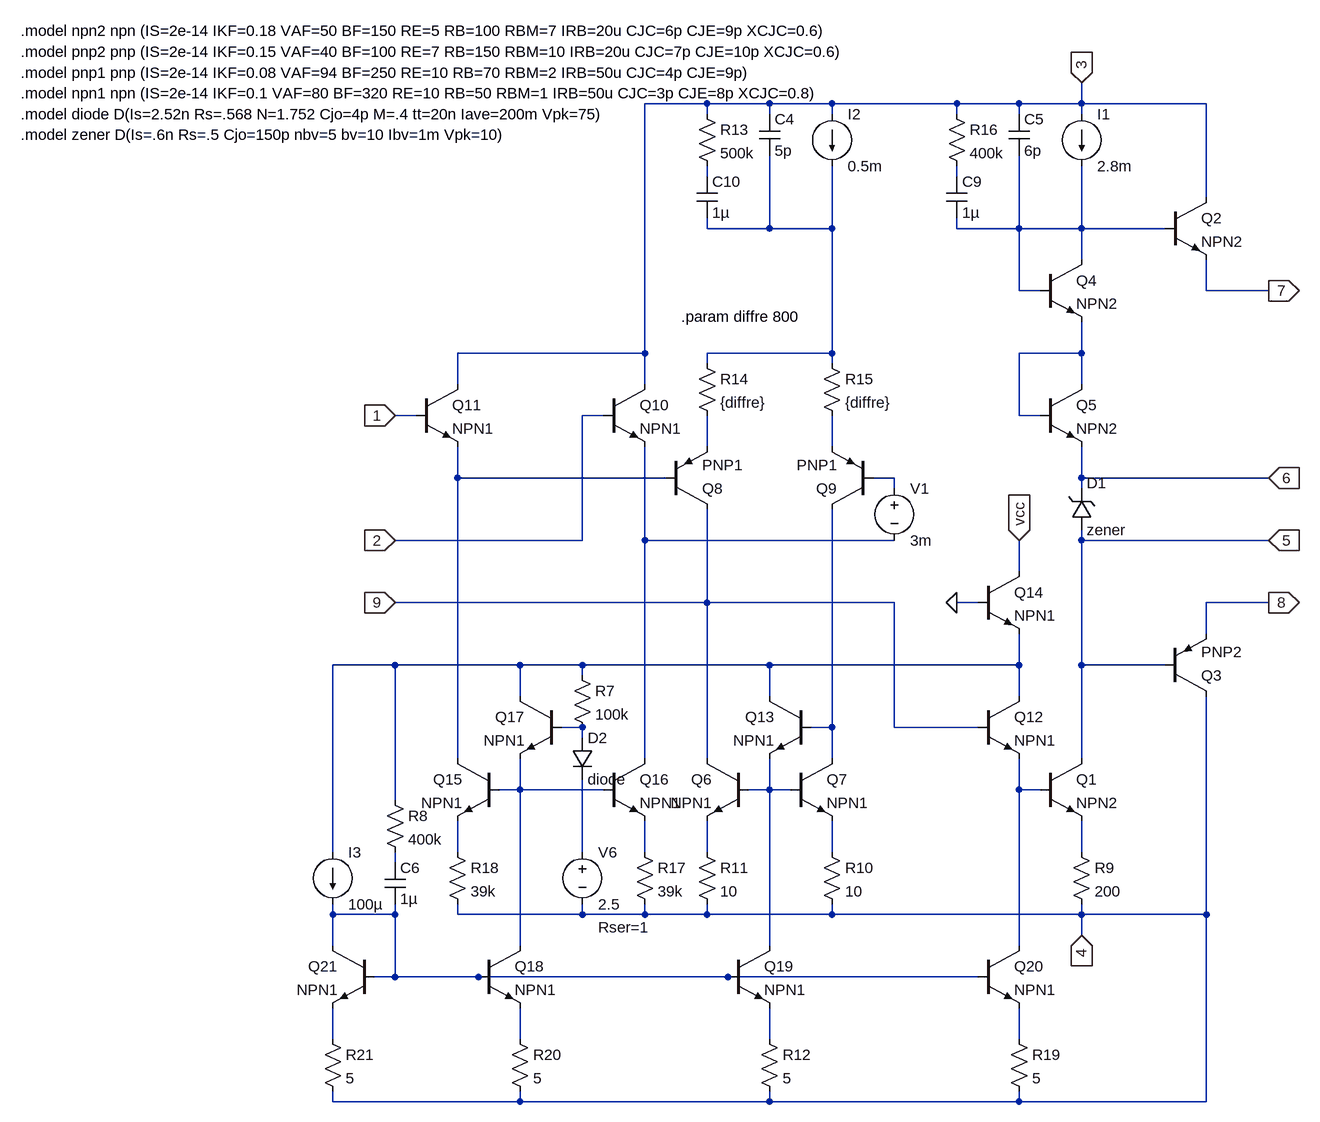
[diagram p0: schematic LME49810.asc]
LME49810.asc, the LTspice schematic file:
Version 4
SHEET 1 1204 680
WIRE 0 -1184 -96 -1184
WIRE 96 -1184 0 -1184
WIRE 192 -1184 96 -1184
WIRE 384 -1184 192 -1184
WIRE 480 -1184 384 -1184
WIRE 576 -1184 576 -1216
WIRE 576 -1184 480 -1184
WIRE 768 -1184 576 -1184
WIRE 0 -1168 0 -1184
WIRE 96 -1168 96 -1184
WIRE 192 -1168 192 -1184
WIRE 384 -1168 384 -1184
WIRE 480 -1168 480 -1184
WIRE 576 -1168 576 -1184
WIRE 0 -1072 0 -1088
WIRE 384 -1072 384 -1088
WIRE 768 -1040 768 -1184
WIRE 0 -992 0 -1008
WIRE 96 -992 96 -1104
WIRE 96 -992 0 -992
WIRE 192 -992 192 -1088
WIRE 192 -992 96 -992
WIRE 384 -992 384 -1008
WIRE 480 -992 480 -1104
WIRE 480 -992 384 -992
WIRE 576 -992 576 -1088
WIRE 576 -992 480 -992
WIRE 704 -992 576 -992
WIRE 576 -944 576 -992
WIRE 480 -896 480 -992
WIRE 512 -896 480 -896
WIRE 768 -896 768 -944
WIRE 864 -896 768 -896
WIRE -96 -800 -96 -1184
WIRE -96 -800 -384 -800
WIRE 192 -800 192 -992
WIRE 192 -800 0 -800
WIRE 576 -800 576 -848
WIRE 576 -800 480 -800
WIRE 0 -784 0 -800
WIRE 192 -784 192 -800
WIRE -384 -752 -384 -800
WIRE -96 -752 -96 -800
WIRE 576 -752 576 -800
WIRE -448 -704 -480 -704
WIRE -160 -704 -192 -704
WIRE 480 -704 480 -800
WIRE 512 -704 480 -704
WIRE 0 -656 0 -704
WIRE 192 -656 192 -704
WIRE -384 -608 -384 -656
WIRE -64 -608 -384 -608
WIRE 288 -608 256 -608
WIRE 576 -608 576 -656
WIRE 864 -608 576 -608
WIRE 288 -592 288 -608
WIRE 576 -592 576 -608
WIRE -192 -512 -192 -704
WIRE -192 -512 -480 -512
WIRE -96 -512 -96 -656
WIRE 288 -512 -96 -512
WIRE 576 -512 576 -528
WIRE 864 -512 576 -512
WIRE 480 -464 480 -512
WIRE 0 -416 0 -560
WIRE 0 -416 -480 -416
WIRE 288 -416 0 -416
WIRE 416 -416 384 -416
WIRE 864 -416 768 -416
WIRE 768 -368 768 -416
WIRE -480 -320 -576 -320
WIRE -288 -320 -480 -320
WIRE -192 -320 -288 -320
WIRE 96 -320 -192 -320
WIRE 480 -320 480 -368
WIRE 480 -320 96 -320
WIRE 576 -320 576 -512
WIRE 704 -320 576 -320
WIRE -192 -304 -192 -320
WIRE -288 -272 -288 -320
WIRE 96 -272 96 -320
WIRE 480 -272 480 -320
WIRE -192 -224 -224 -224
WIRE 192 -224 192 -560
WIRE 192 -224 160 -224
WIRE 288 -224 288 -416
WIRE 416 -224 288 -224
WIRE -192 -208 -192 -224
WIRE -384 -176 -384 -608
WIRE -96 -176 -96 -512
WIRE 0 -176 0 -416
WIRE 192 -176 192 -224
WIRE 576 -176 576 -320
WIRE -288 -128 -288 -176
WIRE -288 -128 -320 -128
WIRE -160 -128 -288 -128
WIRE 96 -128 96 -176
WIRE 96 -128 64 -128
WIRE 128 -128 96 -128
WIRE 480 -128 480 -176
WIRE 512 -128 480 -128
WIRE -480 -112 -480 -320
WIRE -576 -32 -576 -320
WIRE -384 -32 -384 -80
WIRE -192 -32 -192 -144
WIRE -96 -32 -96 -80
WIRE 0 -32 0 -80
WIRE 192 -32 192 -80
WIRE 576 -32 576 -80
WIRE -480 -16 -480 -32
WIRE -576 64 -576 48
WIRE -480 64 -480 48
WIRE -480 64 -576 64
WIRE -384 64 -384 48
WIRE -192 64 -192 48
WIRE -192 64 -384 64
WIRE -96 64 -96 48
WIRE -96 64 -192 64
WIRE 0 64 0 48
WIRE 0 64 -96 64
WIRE 192 64 192 48
WIRE 192 64 0 64
WIRE 576 64 576 48
WIRE 576 64 192 64
WIRE 768 64 768 -272
WIRE 768 64 576 64
WIRE 576 96 576 64
WIRE -576 112 -576 64
WIRE -288 112 -288 -128
WIRE 96 112 96 -128
WIRE 480 112 480 -128
WIRE -480 160 -480 64
WIRE -480 160 -512 160
WIRE -352 160 -480 160
WIRE 32 160 -352 160
WIRE 416 160 32 160
WIRE -576 256 -576 208
WIRE -288 256 -288 208
WIRE 96 256 96 208
WIRE 480 256 480 208
WIRE -576 352 -576 336
WIRE -288 352 -288 336
WIRE -288 352 -576 352
WIRE 96 352 96 336
WIRE 96 352 -288 352
WIRE 480 352 480 336
WIRE 480 352 96 352
WIRE 768 352 768 64
WIRE 768 352 480 352
FLAG -480 -704 1
IOPIN -480 -704 In
FLAG -480 -512 2
IOPIN -480 -512 In
FLAG -480 -416 9
IOPIN -480 -416 In
FLAG 576 96 4
IOPIN 576 96 In
FLAG 576 -1216 3
IOPIN 576 -1216 In
FLAG 864 -896 7
IOPIN 864 -896 Out
FLAG 864 -416 8
IOPIN 864 -416 Out
FLAG 864 -608 6
IOPIN 864 -608 In
FLAG 864 -512 5
IOPIN 864 -512 In
FLAG 384 -416 0
FLAG 480 -512 vcc
IOPIN 480 -512 In
SYMBOL npn 512 -176 R0
SYMATTR InstName Q1
SYMATTR Value NPN2
SYMBOL current 576 -1168 R0
WINDOW 123 0 0 Left 0
WINDOW 39 0 0 Left 0
SYMATTR InstName I1
SYMATTR Value 2.8m
SYMBOL npn 704 -1040 R0
SYMATTR InstName Q2
SYMATTR Value NPN2
SYMBOL pnp 704 -272 M180
SYMATTR InstName Q3
SYMATTR Value PNP2
SYMBOL npn 512 -944 R0
SYMATTR InstName Q4
SYMATTR Value NPN2
SYMBOL npn 512 -752 R0
SYMATTR InstName Q5
SYMATTR Value NPN2
SYMBOL cap 464 -1168 R0
SYMATTR InstName C5
SYMATTR Value 6p
SYMBOL zener 560 -528 M180
WINDOW 0 24 72 Left 0
WINDOW 3 24 0 Left 0
SYMATTR InstName D1
SYMATTR Value zener
SYMATTR Description Diode
SYMATTR Type diode
SYMBOL npn 64 -176 M0
SYMATTR InstName Q6
SYMATTR Value NPN1
SYMBOL npn 128 -176 R0
SYMATTR InstName Q7
SYMATTR Value NPN1
SYMBOL res 176 -48 R0
SYMATTR InstName R10
SYMATTR Value 10
SYMBOL res -16 -48 R0
SYMATTR InstName R11
SYMATTR Value 10
SYMBOL pnp -64 -560 M180
SYMATTR InstName Q8
SYMATTR Value PNP1
SYMBOL pnp 256 -560 R180
SYMATTR InstName Q9
SYMATTR Value PNP1
SYMBOL current 192 -1168 R0
WINDOW 123 0 0 Left 0
WINDOW 39 0 0 Left 0
SYMATTR InstName I2
SYMATTR Value 0.5m
SYMBOL cap 80 -1168 R0
SYMATTR InstName C4
SYMATTR Value 5p
SYMBOL res -16 -1184 R0
SYMATTR InstName R13
SYMATTR Value 500k
SYMBOL res -16 -800 R0
SYMATTR InstName R14
SYMATTR Value {diffre}
SYMBOL res 176 -800 R0
SYMATTR InstName R15
SYMATTR Value {diffre}
SYMBOL voltage 288 -608 R0
WINDOW 123 0 0 Left 0
WINDOW 39 0 0 Left 0
SYMATTR InstName V1
SYMATTR Value 3m
SYMBOL npn -160 -752 R0
SYMATTR InstName Q10
SYMATTR Value NPN1
SYMBOL npn -448 -752 R0
SYMATTR InstName Q11
SYMATTR Value NPN1
SYMBOL npn 416 -272 R0
SYMATTR InstName Q12
SYMATTR Value NPN1
SYMBOL npn 160 -272 M0
SYMATTR InstName Q13
SYMATTR Value NPN1
SYMBOL cap -16 -1072 R0
SYMATTR InstName C10
SYMATTR Value 1µ
SYMBOL res 560 -48 R0
SYMATTR InstName R9
SYMATTR Value 200
SYMBOL res 368 -1184 R0
SYMATTR InstName R16
SYMATTR Value 400k
SYMBOL cap 368 -1072 R0
SYMATTR InstName C9
SYMATTR Value 1µ
SYMBOL npn 416 -464 R0
SYMATTR InstName Q14
SYMATTR Value NPN1
SYMBOL npn -320 -176 M0
SYMATTR InstName Q15
SYMATTR Value NPN1
SYMBOL npn -160 -176 R0
SYMATTR InstName Q16
SYMATTR Value NPN1
SYMBOL res -112 -48 R0
SYMATTR InstName R17
SYMATTR Value 39k
SYMBOL res -400 -48 R0
SYMATTR InstName R18
SYMATTR Value 39k
SYMBOL npn -224 -272 M0
SYMATTR InstName Q17
SYMATTR Value NPN1
SYMBOL res -208 -320 R0
SYMATTR InstName R7
SYMATTR Value 100k
SYMBOL voltage -192 -48 R0
WINDOW 123 0 0 Left 0
WINDOW 39 24 132 Left 0
SYMATTR SpiceLine Rser=1
SYMATTR InstName V6
SYMATTR Value 2.5
SYMBOL diode -208 -208 R0
SYMATTR InstName D2
SYMATTR Value diode
SYMBOL npn -352 112 R0
SYMATTR InstName Q18
SYMATTR Value NPN1
SYMBOL npn 32 112 R0
SYMATTR InstName Q19
SYMATTR Value NPN1
SYMBOL npn 416 112 R0
SYMATTR InstName Q20
SYMATTR Value NPN1
SYMBOL res 80 240 R0
SYMATTR InstName R12
SYMATTR Value 5
SYMBOL res 464 240 R0
SYMATTR InstName R19
SYMATTR Value 5
SYMBOL res -304 240 R0
SYMATTR InstName R20
SYMATTR Value 5
SYMBOL npn -512 112 M0
SYMATTR InstName Q21
SYMATTR Value NPN1
SYMBOL res -592 240 R0
SYMATTR InstName R21
SYMATTR Value 5
SYMBOL current -576 -32 R0
WINDOW 123 0 0 Left 0
WINDOW 39 0 0 Left 0
SYMATTR InstName I3
SYMATTR Value 100µ
SYMBOL res -496 -128 R0
SYMATTR InstName R8
SYMATTR Value 400k
SYMBOL cap -496 -16 R0
SYMATTR InstName C6
SYMATTR Value 1µ
TEXT -1056 -1200 Left 0 !.model npn1 npn (IS=2e-14 IKF=0.1 VAF=80 BF=320 RE=10 RB=50 RBM=1 IRB=50u CJC=3p CJE=8p XCJC=0.8)
TEXT -1056 -1296 Left 0 !.model npn2 npn (IS=2e-14 IKF=0.18 VAF=50 BF=150 RE=5 RB=100 RBM=7 IRB=20u CJC=6p CJE=9p XCJC=0.6)
TEXT -1056 -1264 Left 0 !.model pnp2 pnp (IS=2e-14 IKF=0.15 VAF=40 BF=100 RE=7 RB=150 RBM=10 IRB=20u CJC=7p CJE=10p XCJC=0.6)
TEXT -1056 -1232 Left 0 !.model pnp1 pnp (IS=2e-14 IKF=0.08 VAF=94 BF=250 RE=10 RB=70 RBM=2 IRB=50u CJC=4p CJE=9p)
TEXT -40 -856 Left 0 !.param diffre 800
TEXT -1056 -1168 Left 0 !.model diode D(Is=2.52n Rs=.568 N=1.752 Cjo=4p M=.4 tt=20n Iave=200m Vpk=75)
TEXT -1056 -1136 Left 0 !.model zener D(Is=.6n Rs=.5 Cjo=150p nbv=5 bv=10 Ibv=1m Vpk=10)

The netlist it stands for:
* LME49810.asc
Q1 5 N016 N022 0 NPN2
I1 3 N004 2.8m
Q2 3 N004 7 0 NPN2
Q3 4 5 8 0 PNP2
Q4 N004 N004 N005 0 NPN2
Q5 N005 N005 6 0 NPN2
C5 3 N004 6p
D1 5 6 zener
Q6 9 N015 N020 0 NPN1
Q7 N013 N015 N021 0 NPN1
R10 N021 4 10
R11 N020 4 10
Q8 9 N008 N006 0 PNP1
Q9 N013 N009 N007 0 PNP1
I2 3 N003 0.5m
C4 3 N003 5p
R13 3 N001 500k
R14 N003 N006 {diffre}
R15 N003 N007 {diffre}
V1 N009 N010 3m
Q10 3 2 N010 0 NPN1
Q11 3 1 N008 0 NPN1
Q12 N011 9 N016 0 NPN1
Q13 N011 N013 N015 0 NPN1
C10 N001 N003 1µ
R9 N022 4 200
R16 3 N002 400k
C9 N002 N004 1µ
Q14 vcc 0 N011 0 NPN1
Q15 N008 N014 N017 0 NPN1
Q16 N010 N014 N019 0 NPN1
R17 N019 4 39k
R18 N017 4 39k
Q17 N011 N012 N014 0 NPN1
R7 N011 N012 100k
V6 N018 4 2.5 Rser=1
D2 N012 N018 diode
Q18 N014 N024 N026 0 NPN1
Q19 N015 N024 N027 0 NPN1
Q20 N016 N024 N028 0 NPN1
R12 N027 4 5
R19 N028 4 5
R20 N026 4 5
Q21 N024 N024 N025 0 NPN1
R21 N025 4 5
I3 N011 N024 100µ
R8 N011 N023 400k
C6 N023 N024 1µ
.model D D
.lib standard.dio
.model NPN NPN
.model PNP PNP
.lib standard.bjt
.model npn1 npn (IS=2e-14 IKF=0.1 VAF=80 BF=320 RE=10 RB=50 RBM=1 IRB=50u CJC=3p CJE=8p XCJC=0.8)
.model npn2 npn (IS=2e-14 IKF=0.18 VAF=50 BF=150 RE=5 RB=100 RBM=7 IRB=20u CJC=6p CJE=9p XCJC=0.6)
.model pnp2 pnp (IS=2e-14 IKF=0.15 VAF=40 BF=100 RE=7 RB=150 RBM=10 IRB=20u CJC=7p CJE=10p XCJC=0.6)
.model pnp1 pnp (IS=2e-14 IKF=0.08 VAF=94 BF=250 RE=10 RB=70 RBM=2 IRB=50u CJC=4p CJE=9p)
.param diffre 800
.model diode D(Is=2.52n Rs=.568 N=1.752 Cjo=4p M=.4 tt=20n Iave=200m Vpk=75)
.model zener D(Is=.6n Rs=.5 Cjo=150p nbv=5 bv=10 Ibv=1m Vpk=10)
.backanno
.end